# Altium project PCB.PrjPcb
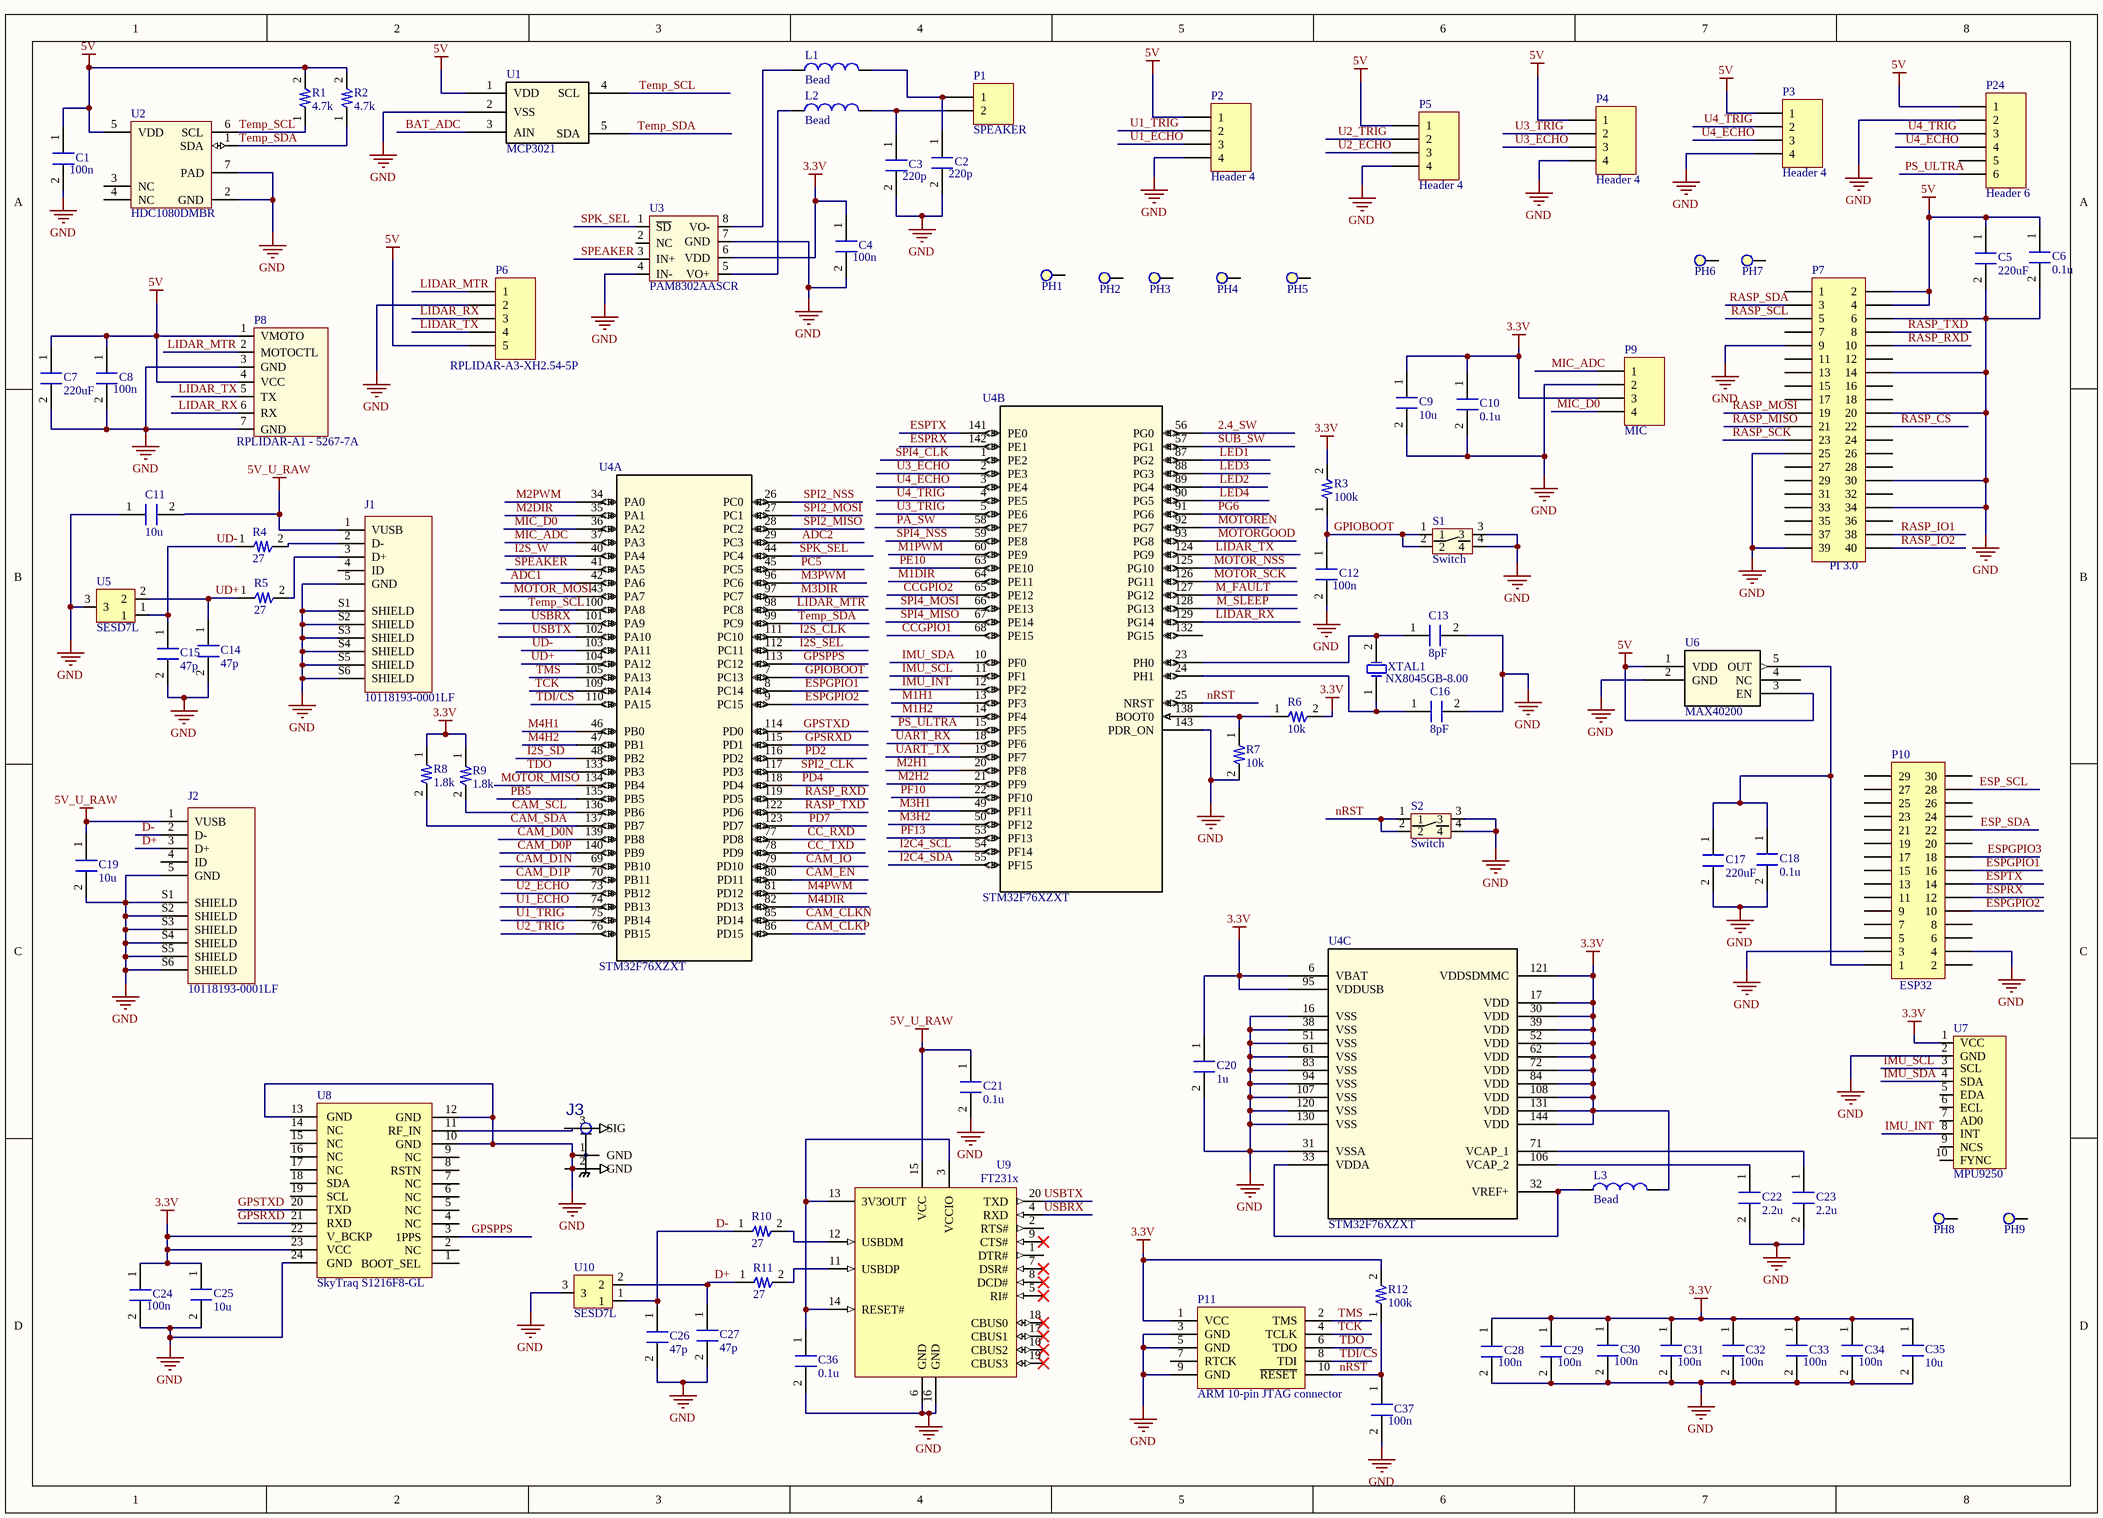
[diagram p0: MCU.SchDoc]
3 sheets, 220 parts. Net scope: global (net labels, ports and power ports of the same name join across sheets).
Board file: PCB.PcbDoc
Sheets:
  MCU.SchDoc
  Peripherals.SchDoc
  Power.SchDoc

## Sheet MCU.SchDoc
size A3

### Parts
C1  value 100n  [Capacitor 0402]  (hidden comment: Ceramic Capacitor)
C2  value 220p  [Capacitor 0402]  (hidden comment: Ceramic Capacitor)
C3  value 220p  [Capacitor 0402]  (hidden comment: Ceramic Capacitor)
C4  value 100n  [Capacitor 0402]  (hidden comment: Ceramic Capacitor)
C5  value 220uF  [CAPAE250P680X1220_VERT]  (hidden comment: Ceramic Capacitor)
C6  value 0.1u  [Capacitor 0402]  (hidden comment: Ceramic Capacitor)
C7  value 220uF  [CAPAE250P680X1220_VERT]  (hidden comment: Ceramic Capacitor)
C8  value 100n  [Capacitor 0402]  (hidden comment: Ceramic Capacitor)
C9  value 10u  [Capacitor 0603]  (hidden comment: Ceramic Capacitor)
C10  value 0.1u  [Capacitor 0402]  (hidden comment: Ceramic Capacitor)
C11  value 10u  [Capacitor 0603]  (hidden comment: Ceramic Capacitor)
C12  value 100n  [Capacitor 0402]  (hidden comment: Ceramic Capacitor)
C13  value 8pF  [Capacitor 0402]  (hidden comment: Ceramic Capacitor)
C14  value 47p  [Capacitor 0402]  (hidden comment: Ceramic Capacitor)
C15  value 47p  [Capacitor 0402]  (hidden comment: Ceramic Capacitor)
C16  value 8pF  [Capacitor 0402]  (hidden comment: Ceramic Capacitor)
C17  value 220uF  [CAPAE250P680X1220_VERT]  (hidden comment: Ceramic Capacitor)
C18  value 0.1u  [Capacitor 0402]  (hidden comment: Ceramic Capacitor)
C19  value 10u  [Capacitor 0603]  (hidden comment: Ceramic Capacitor)
C20  value 1u  [Capacitor 0402]  (hidden comment: Ceramic Capacitor)
C21  value 0.1u  [Capacitor 0402]  (hidden comment: Ceramic Capacitor)
C22  value 2.2u  [Capacitor 0402]  (hidden comment: Ceramic Capacitor)
C23  value 2.2u  [Capacitor 0402]  (hidden comment: Ceramic Capacitor)
C24  value 100n  [Capacitor 0402]  (hidden comment: Ceramic Capacitor)
C25  value 10u  [Capacitor 0603]  (hidden comment: Ceramic Capacitor)
C26  value 47p  [Capacitor 0402]  (hidden comment: Ceramic Capacitor)
C27  value 47p  [Capacitor 0402]  (hidden comment: Ceramic Capacitor)
C28  value 100n  [Capacitor 0402]  (hidden comment: Ceramic Capacitor)
C29  value 100n  [Capacitor 0402]  (hidden comment: Ceramic Capacitor)
C30  value 100n  [Capacitor 0402]  (hidden comment: Ceramic Capacitor)
C31  value 100n  [Capacitor 0402]  (hidden comment: Ceramic Capacitor)
C32  value 100n  [Capacitor 0402]  (hidden comment: Ceramic Capacitor)
C33  value 100n  [Capacitor 0402]  (hidden comment: Ceramic Capacitor)
C34  value 100n  [Capacitor 0402]  (hidden comment: Ceramic Capacitor)
C35  value 10u  [Capacitor 0603]  (hidden comment: Ceramic Capacitor)
C36  value 0.1u  [Capacitor 0402]  (hidden comment: Ceramic Capacitor)
C37  value 100n  [Capacitor 0402]  (hidden comment: Ceramic Capacitor)
J1  10118193-0001LF  [FCI_10118193-0001LF_10118193-0001LF(Primary)]
J2  10118193-0001LF  [FCI_10118193-0001LF_10118193-0001LF(Primary)]
J3  U.FL-R-SMT(01)  [HRS_U.FL-R-SMT(01)]  (value not drawn)
L1  Bead  [Resistor 0603]
L2  Bead  [Resistor 0603]
L3  Bead  [Resistor 0603]
P1  SPEAKER  [HDR1X2]
P2  Header 4  [HDR1X4]
P3  Header 4  [HDR1X4]
P4  Header 4  [HDR1X4]
P5  Header 4  [HDR1X4]
P6  RPLIDAR-A3-XH2.54-5P  [HDR1X5]
P7  PI 3.0  [HDR2X20]
P8  RPLIDAR-A1 - 5267-7A  [HDR1X7]
P9  MIC  [HDR1X4]
P10  ESP32  [ESP32]
P11  ARM 10-pin JTAG connector  [MHDR2X5]
P24  Header 6  [HDR1X6]
PH1  Plated Hole  [PH-M3-A]  (value not drawn)
PH2  Plated Hole  [PH-M3-A]  (value not drawn)
PH3  Plated Hole  [PH-M3-A]  (value not drawn)
PH4  Plated Hole  [PH-M3-A]  (value not drawn)
PH5  Plated Hole  [PH-M3-A]  (value not drawn)
PH6  Plated Hole  [PH-M2-A]  (value not drawn)
PH7  Plated Hole  [PH-M2-A]  (value not drawn)
PH8  Plated Hole  [PH-M3-A]  (value not drawn)
PH9  Plated Hole  [PH-M3-A]  (value not drawn)
R1  value 4.7k  [Resistor 0402]  (hidden comment: Resistor)
R2  value 4.7k  [Resistor 0402]  (hidden comment: Resistor)
R3  value 100k  [Resistor 0402]  (hidden comment: Resistor)
R4  value 27  [Resistor 0402]  (hidden comment: Resistor)
R5  value 27  [Resistor 0402]  (hidden comment: Resistor)
R6  value 10k  [Resistor 0402]  (hidden comment: Resistor)
R7  value 10k  [Resistor 0402]  (hidden comment: Resistor)
R8  value 1.8k  [Resistor 0402]  (hidden comment: Resistor)
R9  value 1.8k  [Resistor 0402]  (hidden comment: Resistor)
R10  value 27  [Resistor 0402]  (hidden comment: Resistor)
R11  value 27  [Resistor 0402]  (hidden comment: Resistor)
R12  value 100k  [Resistor 0402]  (hidden comment: Resistor)
S1  Switch  [Switch]
S2  Switch  [Switch]
U1  MCP3021  [SOT23-5N]
U2  HDC1080DMBR  [DMB0006A]
U3  PAM8302AASCR  [MSOP-MS8_N]
U4  STM32F76XZXT  [LQFP-144_20X20mm]  (parts A,B,C of 3)
U5  SESD7L  [SOT-723]
U6  MAX40200  [21-0057F]
U7  MPU9250  [HDR1X10]
U8  SkyTraq S1216F8-GL  [SkyTraq S1216F8-GL]
U9  FT231x  [SSOP-20_N]
U10  SESD7L  [SOT-723]
XTAL1  NX8045GB-8.00  [NX8045G 8MHz Crystal]

### Nets
3.3V: C4.1 C9.1 C10.1 C20.1 C24.1 C25.1 C28.1 C29.1 C30.1 C31.1 C32.1 C33.1 C34.1 C35.1 L3.2 P9.3 P11.1(VCC) R3.2 R6.2 R8.1 R9.1 R12.2 U3.6(VDD) U4.6(VBAT) U4.17(VDD) U4.30(VDD) U4.39(VDD) U4.52(VDD) U4.62(VDD) U4.72(VDD) U4.84(VDD) U4.95(VDDUSB) U4.108(VDD) U4.121(VDDSDMMC) U4.131(VDD) U4.144(VDD) U7.1(VCC) U8.22(V_BCKP) U8.23(VCC)
5V: C1.1 C5.1 C6.1 C7.1 C8.1 P2.1 P3.1 P4.1 P5.1 P6.5 P7.2 P7.4 P8.1(VMOTO) P8.4(VCC) P24.1 R1.2 R2.2 U1.1(VDD) U2.5(VDD) U6.1(VDD) U6.3(EN)
5V_U_RAW: C11.2 C19.1 C21.1 J1.1(VUSB) J2.1(VUSB) U9.15(VCC)
GND: C1.2 C2.2 C3.2 C4.2 C5.2 C6.2 C7.2 C8.2 C9.2 C10.2 C11.1 C12.2 C13.2 C14.2 C15.2 C16.2 C17.2 C18.2 C19.2 C20.2 C21.2 C22.2 C23.2 C24.2 C25.2 C26.2 C27.2 C28.2 C29.2 C30.2 C31.2 C32.2 C33.2 C34.2 C35.2 C36.2 C37.2 J1.5(GND) J1.S1(SHIELD) J1.S2(SHIELD) J1.S3(SHIELD) J1.S4(SHIELD) J1.S5(SHIELD) J1.S6(SHIELD) J2.5(GND) J2.S1(SHIELD) J2.S2(SHIELD) J2.S3(SHIELD) J2.S4(SHIELD) J2.S5(SHIELD) J2.S6(SHIELD) J3.1(GND) J3.2(GND) P2.4 P3.4 P4.4 P5.4 P6.2 P7.6 P7.9 P7.14 P7.20 P7.25 P7.30 P7.34 P7.39 P8.3(GND) P8.7(GND) P9.2 P10.3 P10.4 P11.3(GND) P11.5(GND) P11.9(GND) P24.2 R7.2 S1.3 S1.4 S2.3 S2.4 U1.2(VSS) U2.2(GND) U2.7(PAD) U3.4(IN-) U3.7(GND) U4.16(VSS) U4.31(VSSA) U4.38(VSS) U4.51(VSS) U4.61(VSS) U4.83(VSS) U4.94(VSS) U4.107(VSS) U4.120(VSS) U4.130(VSS) U4.143(PDR_ON) U5.3 U6.2(GND) U7.2(GND) U8.10(GND) U8.12(GND) U8.13(GND) U8.24(GND) U9.6(GND) U9.16(GND) U10.3
2.4_SW: U4.56(PG0)
ADC1: U4.42(PA6)
ADC2: U4.29(PC3)
BAT_ADC: U1.3(AIN)
CAM_CLKN: U4.85(PD14)
CAM_CLKP: U4.86(PD15)
CAM_D0N: U4.139(PB8)
CAM_D0P: U4.140(PB9)
CAM_D1N: U4.69(PB10)
CAM_D1P: U4.70(PB11)
CAM_EN: U4.80(PD11)
CAM_IO: U4.79(PD10)
CAM_SCL: R9.2 U4.136(PB6)
CAM_SDA: R8.2 U4.137(PB7)
CC_RXD: U4.77(PD8)
CC_TXD: U4.78(PD9)
CCGPIO1: U4.68(PE15)
CCGPIO2: U4.65(PE12)
D+: C27.1 J2.3(D+) R11.1 U10.2
D-: C26.1 J2.2(D-) R10.1 U10.1
ESP_SCL: P10.28
ESP_SDA: P10.22
ESPGPIO1: P10.16 U4.8(PC14)
ESPGPIO2: P10.10 U4.9(PC15)
ESPGPIO3: P10.18
ESPRX: P10.12 U4.142(PE1)
ESPTX: P10.14 U4.141(PE0)
GPIOBOOT: C12.1 R3.1 S1.1 S1.2 U4.7(PC13)
GPSPPS: U4.113(PC12) U8.3(1PPS)
GPSRXD: U4.115(PD1) U8.21(RXD)
GPSTXD: U4.114(PD0) U8.20(TXD)
I2C4_SCL: U4.54(PF14)
I2C4_SDA: U4.55(PF15)
I2S_CLK: U4.111(PC10)
I2S_SD: U4.48(PB2)
I2S_SEL: U4.112(PC11)
I2S_W: U4.40(PA4)
IMU_INT: U4.12(PF2) U7.8(INT)
IMU_SCL: U4.11(PF1) U7.3(SCL)
IMU_SDA: U4.10(PF0) U7.4(SDA)
LED1: U4.87(PG2)
LED2: U4.89(PG4)
LED3: U4.88(PG3)
LED4: U4.90(PG5)
LIDAR_MTR: P6.1 P8.2(MOTOCTL) U4.98(PC8)
LIDAR_RX: P6.3 P8.6(RX) U4.129(PG14)
LIDAR_TX: P6.4 P8.5(TX) U4.124(PG9)
M1DIR: U4.64(PE11)
M1H1: U4.13(PF3)
M1H2: U4.14(PF4)
M1PWM: U4.60(PE9)
M2DIR: U4.35(PA1)
M2H1: U4.20(PF8)
M2H2: U4.21(PF9)
M2PWM: U4.34(PA0)
M3DIR: U4.97(PC7)
M3H1: U4.49(PF11)
M3H2: U4.50(PF12)
M3PWM: U4.96(PC6)
M4DIR: U4.82(PD13)
M4H1: U4.46(PB0)
M4H2: U4.47(PB1)
M4PWM: U4.81(PD12)
M_FAULT: U4.127(PG12)
M_SLEEP: U4.128(PG13)
MIC_ADC: P9.1 U4.37(PA3)
MIC_D0: P9.4 U4.36(PA2)
MOTOR_MISO: U4.134(PB4)
MOTOR_MOSI: U4.43(PA7)
MOTOR_NSS: U4.125(PG10)
MOTOR_SCK: U4.126(PG11)
MOTOREN: U4.92(PG7)
MOTORGOOD: U4.93(PG8)
nRST: C37.1 P11.10(~{RESET}) R12.1 S2.1 S2.2 U4.25(NRST)
PA_SW: U4.58(PE7)
PB5: U4.135(PB5)
PC5: U4.45(PC5)
PD2: U4.116(PD2)
PD4: U4.118(PD4)
PD7: U4.123(PD7)
PE10: U4.63(PE10)
PF10: U4.22(PF10)
PF13: U4.53(PF13)
PG6: U4.91(PG6)
PS_ULTRA: P24.6 U4.15(PF5)
RASP_CS: P7.22
RASP_IO1: P7.38
RASP_IO2: P7.40
RASP_MISO: P7.21
RASP_MOSI: P7.19
RASP_RXD: P7.10 U4.119(PD5)
RASP_SCK: P7.23
RASP_SCL: P7.5
RASP_SDA: P7.3
RASP_TXD: P7.8 U4.122(PD6)
SPEAKER: U3.3(IN+) U4.41(PA5)
SPI2_CLK: U4.117(PD3)
SPI2_MISO: U4.28(PC2)
SPI2_MOSI: U4.27(PC1)
SPI2_NSS: U4.26(PC0)
SPI4_CLK: U4.1(PE2)
SPI4_MISO: U4.67(PE14)
SPI4_MOSI: U4.66(PE13)
SPI4_NSS: U4.59(PE8)
SPK_SEL: U3.1(~{SD}) U4.44(PC4)
SUB_SW: U4.57(PG1)
TCK: P11.4(TCLK) U4.109(PA14)
TDI/CS: P11.8(TDI) U4.110(PA15)
TDO: P11.6(TDO) U4.133(PB3)
Temp_SCL: R1.1 U1.4(SCL) U2.6(SCL) U4.100(PA8)
Temp_SDA: R2.1 U1.5(SDA) U2.1(SDA) U4.99(PC9)
TMS: P11.2(TMS) U4.105(PA13)
U1_ECHO: P2.3 U4.74(PB13)
U1_TRIG: P2.2 U4.75(PB14)
U2_ECHO: P5.3 U4.73(PB12)
U2_TRIG: P5.2 U4.76(PB15)
U3_ECHO: P4.3 U4.2(PE3)
U3_TRIG: P4.2 U4.5(PE6)
U4_ECHO: P3.3 P24.4 U4.3(PE4)
U4_TRIG: P3.2 P24.3 U4.4(PE5)
UART_RX: U4.18(PF6)
UART_TX: U4.19(PF7)
UD+: C14.1 R5.1 U4.104(PA12) U5.2
UD-: C15.1 R4.1 U4.103(PA11) U5.1
USBRX: U4.101(PA9) U9.4(RXD)
USBTX: U4.102(PA10) U9.20(TXD)
NetC2_1: C2.1 L1.2 P1.1
NetC3_1: C3.1 L2.2 P1.2
NetC13_1: C13.1 U4.23(PH0) XTAL1.2(OSC2)
NetC16_1: C16.1 U4.24(PH1) XTAL1.1(OSC1)
NetC17_1: C17.1 C18.1 P10.1 U6.5(OUT)
NetC22_1: C22.1 U4.106(VCAP_2)
NetC23_1: C23.1 U4.71(VCAP_1)
NetC36_1: C36.1 U9.3(VCCIO) U9.13(3V3OUT) U9.14(RESET#)
NetJ1_2: J1.2(D-) R4.2
NetJ1_3: J1.3(D+) R5.2
NetJ3_3: J3.3(SIG) U8.11(RF_IN)
NetL1_1: L1.1 U3.8(VO-)
NetL2_1: L2.1 U3.5(VO+)
NetL3_1: L3.1 U4.32(VREF+) U4.33(VDDA)
NetR6_1: R6.1 R7.1 U4.138(BOOT0)
NetR10_2: R10.2 U9.12(USBDM)
NetR11_2: R11.2 U9.11(USBDP)

Not connected (* = marked no-connect by the designer): J1 4(ID); J2 4(ID); P7 1 7 11 12 13 15 16 17 18 24 26 27 28 29 31 32 33 35 36 37; P10 2 5 6 7 8 9 11 13 15 17 19 20 21 23 24 25 26 27 29 30; P11 7(RTCK); P24 5; PH1 1(Hole); PH2 1(Hole); PH3 1(Hole); PH4 1(Hole); PH5 1(Hole); PH6 1(Hole); PH7 1(Hole); PH8 1(Hole); PH9 1(Hole); U2 3(NC) 4(NC); U3 2(NC); U4 132(PG15); U6 4(NC); U7 5(EDA) 6(ECL) 7(AD0) 9(NCS) 10(FYNC); U8 1(BOOT_SEL) 2(NC) 4(NC) 5(NC) 6(NC) 7(NC) 8(RSTN) 9(NC) 14(NC) 15(NC) 16(NC) 17(NC) 18(SDA) 19(SCL); U9 1(DTR#) 2(RTS#) 5(RI#)* 7(DSR#)* 8(DCD#)* 9(CTS#)* 10(CBUS2)* 17(CBUS1)* 18(CBUS0)* 19(CBUS3)*

### Library data of the parts
J1 J2 = USB mini 10118193-0001LF: USB mini; Digikey: *
J3 = U.FL-R-SMT(01): U.FL Series 6 Ghz 50 Ohm Ultra-small SMT Coaxial Cable Receptacle; MF: Hirose; Price: 0.80 USD; Availability: Good; Package: None; MP: U.FL-R-SMT(01); Value: *
L1-L3 = Inductor: Digikey: 490-13259-1-ND
P1 = Header 2: Header, 2-Pin; LatestRevisionDate: 17-Jul-2002; LatestRevisionNote: Re-released for DXP Platform.; Publisher: Altium Limited
P2-P5 P9 = Header 4: Header, 4-Pin; LatestRevisionDate: 17-Jul-2002; LatestRevisionNote: Re-released for DXP Platform.; Publisher: Altium Limited
P6 = Header 5: Header, 5-Pin; LatestRevisionDate: 17-Jul-2002; LatestRevisionNote: Re-released for DXP Platform.; Publisher: Altium Limited
P7 = Header 20X2: Header, 20-Pin, Dual row; LatestRevisionDate: 17-Jul-2002; LatestRevisionNote: Re-released for DXP Platform.; Publisher: Altium Limited
P8 = RPLIDAR A1
P10 = Header 15X2: Header, 15-Pin, Dual row; LatestRevisionDate: 17-Jul-2002; LatestRevisionNote: Re-released for DXP Platform.; Publisher: Altium Limited
P11 = ARM JTAG: ARM JTAG/SWD connector; Farnell Code: 1865279
P24 = Header 6: Header, 6-Pin; LatestRevisionDate: 17-Jul-2002; LatestRevisionNote: Re-released for DXP Platform.; Publisher: Altium Limited
PH1-PH9 = PH: Plated hole for threaded rods; LatestRevisionDate: 31-07-2014; Published: 31-07-2014; Publisher: N.F.Baltazar Santos - DelFFi
R1-R12 = Resistor: General Purpose Resistor
  R1-R3 R6-R9 R12: Digikey: *
  R4 R5 R10 R11: Digikey: P27DDCT-ND
U1 = MCP3021: ADC
U2 = HDC1080DMBR: No Description Available; Application_BuildNumber: *
U3 = PAM8302AASCR: Speaker amplifier
U4 = STM32F76XZXT: Imported; Vendor: STMicroelectronics; C: Copyright (C) 2016 Accelerated Designs. All rights reserved; Manufacturer_Part_Number: stm32f76xzxt; Copyright: Copyright (C) 2016 Accelerated Designs. All rights reserved; RefDes: RefDes; Type: DEV; Value: Value
U5 U10 = SESD7L: TVS Diode - USB
U6 = MAX40200: No Description Available
U8 = SkyTraq S1216F8-GL: Skytraq S1216F8-GL GPS chip
XTAL1 = NDK NX8045G 8MHz: Surface Mount Quartz Crystal; Value: 8MHz; Digikey: NX8045GB-8.00
C1-C37 = Ceramic Capacitor
  C1-C13 C16-C25 C28-C37: Digikey: *
  C14 C15 C26 C27: Digikey: 445-5592-1-ND
U9 = FT231x: Digikey: 768-1129-1-ND

## Sheet Peripherals.SchDoc
size A3
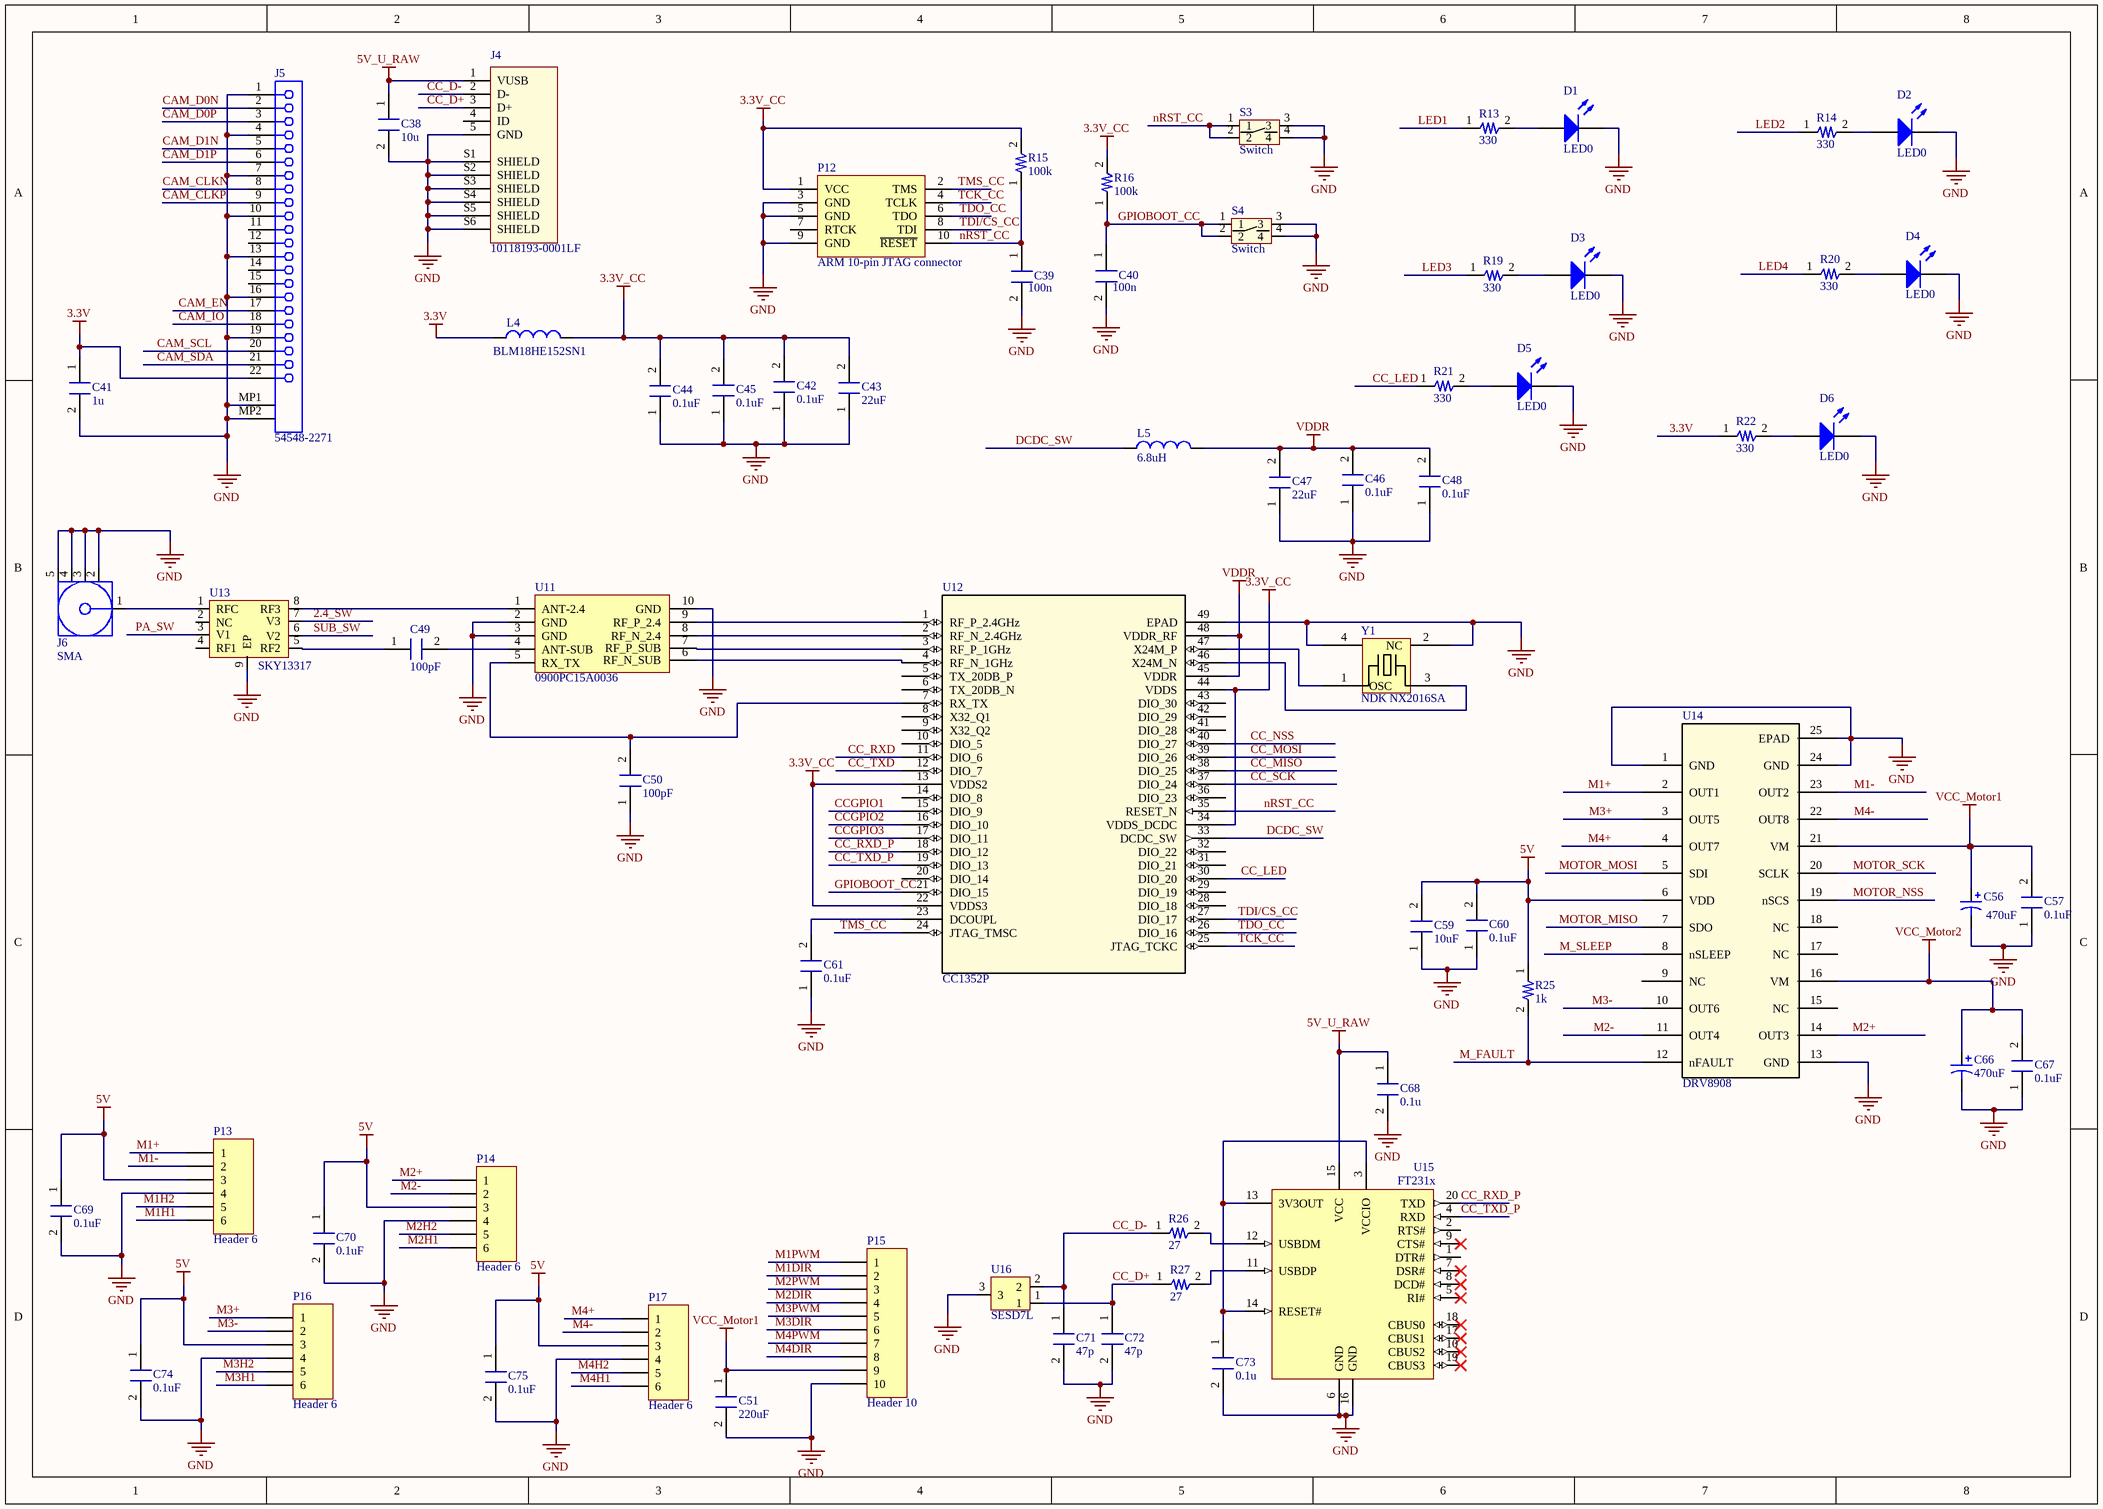
[diagram p1: Peripherals.SchDoc]

### Parts
C38  value 10u  [Capacitor 0603]  (hidden comment: Ceramic Capacitor)
C39  value 100n  [Capacitor 0402]  (hidden comment: Ceramic Capacitor)
C40  value 100n  [Capacitor 0402]  (hidden comment: Ceramic Capacitor)
C41  value 1u  [Capacitor 0402]  (hidden comment: Ceramic Capacitor)
C42  value 0.1uF  [Capacitor 0402]  (hidden comment: Ceramic Capacitor)
C43  value 22uF  [Capacitor 0603]  (hidden comment: Ceramic Capacitor)
C44  value 0.1uF  [Capacitor 0402]  (hidden comment: Ceramic Capacitor)
C45  value 0.1uF  [Capacitor 0402]  (hidden comment: Ceramic Capacitor)
C46  value 0.1uF  [Capacitor 0402]  (hidden comment: Ceramic Capacitor)
C47  value 22uF  [Capacitor 0603]  (hidden comment: Ceramic Capacitor)
C48  value 0.1uF  [Capacitor 0402]  (hidden comment: Ceramic Capacitor)
C49  value 100pF  [Capacitor 0402]  (hidden comment: Ceramic Capacitor)
C50  value 100pF  [Capacitor 0402]  (hidden comment: Ceramic Capacitor)
C51  value 220uF  [CAPAE250P680X1220_VERT]  (hidden comment: Ceramic Capacitor)
C56  470uF  [RB7.6-15]
C57  value 0.1uF  [Capacitor 0402]  (hidden comment: Ceramic Capacitor)
C59  value 10uF  [Capacitor 0603]  (hidden comment: Ceramic Capacitor)
C60  value 0.1uF  [Capacitor 0402]  (hidden comment: Ceramic Capacitor)
C61  value 0.1uF  [Capacitor 0402]  (hidden comment: Ceramic Capacitor)
C66  470uF  [RB7.6-15]
C67  value 0.1uF  [Capacitor 0402]  (hidden comment: Ceramic Capacitor)
C68  value 0.1u  [Capacitor 0402]  (hidden comment: Ceramic Capacitor)
C69  value 0.1uF  [Capacitor 0402]  (hidden comment: Ceramic Capacitor)
C70  value 0.1uF  [Capacitor 0402]  (hidden comment: Ceramic Capacitor)
C71  value 47p  [Capacitor 0402]  (hidden comment: Ceramic Capacitor)
C72  value 47p  [Capacitor 0402]  (hidden comment: Ceramic Capacitor)
C73  value 0.1u  [Capacitor 0402]  (hidden comment: Ceramic Capacitor)
C74  value 0.1uF  [Capacitor 0402]  (hidden comment: Ceramic Capacitor)
C75  value 0.1uF  [Capacitor 0402]  (hidden comment: Ceramic Capacitor)
D1  LED0  [HDR1X2]
D2  LED0  [HDR1X2]
D3  LED0  [HDR1X2]
D4  LED0  [HDR1X2]
D5  LED0  [HDR1X2]
D6  LED0  [HDR1X2]
J4  10118193-0001LF  [FCI_10118193-0001LF_10118193-0001LF(Primary)]
J5  54548-2271  [54548-2271]
J6  SMA  [SMA4.75V5A - Straight]
L4  BLM18HE152SN1  [Resistor 0603]
L5  6.8uH  [B82144F2682K000]
P12  ARM 10-pin JTAG connector  [MHDR2X5]
P13  Header 6  [HDR1X6]
P14  Header 6  [HDR1X6]
P15  Header 10  [HDR1X10]
P16  Header 6  [HDR1X6]
P17  Header 6  [HDR1X6]
R13  value 330  [Resistor 0402]  (hidden comment: Resistor)
R14  value 330  [Resistor 0402]  (hidden comment: Resistor)
R15  value 100k  [Resistor 0402]  (hidden comment: Resistor)
R16  value 100k  [Resistor 0402]  (hidden comment: Resistor)
R19  value 330  [Resistor 0402]  (hidden comment: Resistor)
R20  value 330  [Resistor 0402]  (hidden comment: Resistor)
R21  value 330  [Resistor 0402]  (hidden comment: Resistor)
R22  value 330  [Resistor 0402]  (hidden comment: Resistor)
R25  value 1k  [Resistor 0402]  (hidden comment: Resistor)
R26  value 27  [Resistor 0402]  (hidden comment: Resistor)
R27  value 27  [Resistor 0402]  (hidden comment: Resistor)
S3  Switch  [Switch]
S4  Switch  [Switch]
U11  0900PC15A0036  [0900PC15A0036]
U12  CC1352P  [RGZ48]
U13  SKY13317  [DFN-8_DC]
U14  DRV8908  [HTTSOP 24]
U15  FT231x  [SSOP-20_N]
U16  SESD7L  [SOT-723]
Y1  NDK NX2016SA  [NDK NX2016SA]

### Nets
3.3V: C41.1 J5.22 L4.1 R22.1
3.3V_CC: C42.2 C43.2 C44.2 C45.2 L4.2 P12.1(VCC) R15.2 R16.2 U12.13(VDDS2) U12.22(VDDS3) U12.34(VDDS_DCDC) U12.44(VDDS)
5V: C59.2 C60.2 C69.1 C70.1 C74.1 C75.1 P13.3 P14.3 P16.3 P17.3 R25.1 U14.6(VDD)
5V_U_RAW: C38.1 C68.1 J4.1(VUSB) U15.15(VCC)
GND: C38.2 C39.2 C40.2 C41.2 C42.1 C43.1 C44.1 C45.1 C46.1 C47.1 C48.1 C50.1 C51.2 C56.2 C57.1 C59.1 C60.1 C61.1 C66.2 C67.1 C68.2 C69.2 C70.2 C71.2 C72.2 C73.2 C74.2 C75.2 D1.2(K) D2.2(K) D3.2(K) D4.2(K) D5.2(K) D6.2(K) J4.5(GND) J4.S1(SHIELD) J4.S2(SHIELD) J4.S3(SHIELD) J4.S4(SHIELD) J4.S5(SHIELD) J4.S6(SHIELD) J5.1 J5.4 J5.7 J5.10 J5.13 J5.16 J5.19 J5.MP1 J5.MP2 J6.2 J6.3 J6.4 J6.5 P12.3(GND) P12.5(GND) P12.9(GND) P13.4 P14.4 P15.10 P16.4 P17.4 S3.3 S3.4 S4.3 S4.4 U11.2(GND) U11.3(GND) U11.10(GND) U12.49(EPAD) U13.9(EP) U14.1(GND) U14.13(GND) U14.24(GND) U14.25(EPAD) U15.6(GND) U15.16(GND) U16.3 Y1.2(NC) Y1.4(NC)
VCC_Motor1: C51.1 C56.1 C57.2 P15.9 U14.21(VM)
VCC_Motor2: C66.1 C67.2 U14.16(VM)
VDDR: C46.2 C47.2 C48.2 L5.2 U12.45(VDDR) U12.48(VDDR_RF)
2.4_SW: U13.7(V3)
CAM_CLKN: J5.8
CAM_CLKP: J5.9
CAM_D0N: J5.2
CAM_D0P: J5.3
CAM_D1N: J5.5
CAM_D1P: J5.6
CAM_EN: J5.17
CAM_IO: J5.18
CAM_SCL: J5.20
CAM_SDA: J5.21
CC_D+: C72.1 J4.3(D+) R27.1 U16.1
CC_D-: C71.1 J4.2(D-) R26.1 U16.2
CC_LED: R21.1 U12.30(DIO_20)
CC_MISO: U12.38(DIO_25)
CC_MOSI: U12.39(DIO_26)
CC_NSS: U12.40(DIO_27)
CC_RXD: U12.11(DIO_6)
CC_RXD_P: U12.18(DIO_12) U15.20(TXD)
CC_SCK: U12.37(DIO_24)
CC_TXD: U12.12(DIO_7)
CC_TXD_P: U12.19(DIO_13) U15.4(RXD)
CCGPIO1: U12.15(DIO_9)
CCGPIO2: U12.16(DIO_10)
CCGPIO3: U12.17(DIO_11)
DCDC_SW: L5.1 U12.33(DCDC_SW)
GPIOBOOT_CC: C40.1 R16.1 S4.1 S4.2 U12.21(DIO_15)
LED1: R13.1
LED2: R14.1
LED3: R19.1
LED4: R20.1
M1+: P13.1 U14.2(OUT1)
M1-: P13.2 U14.23(OUT2)
M1DIR: P15.2
M1H1: P13.6
M1H2: P13.5
M1PWM: P15.1
M2+: P14.1 U14.14(OUT3)
M2-: P14.2 U14.11(OUT4)
M2DIR: P15.4
M2H1: P14.6
M2H2: P14.5
M2PWM: P15.3
M3+: P16.1 U14.3(OUT5)
M3-: P16.2 U14.10(OUT6)
M3DIR: P15.6
M3H1: P16.6
M3H2: P16.5
M3PWM: P15.5
M4+: P17.1 U14.4(OUT7)
M4-: P17.2 U14.22(OUT8)
M4DIR: P15.8
M4H1: P17.6
M4H2: P17.5
M4PWM: P15.7
M_FAULT: R25.2 U14.12(nFAULT)
M_SLEEP: U14.8(nSLEEP)
MOTOR_MISO: U14.7(SDO)
MOTOR_MOSI: U14.5(SDI)
MOTOR_NSS: U14.19(nSCS)
MOTOR_SCK: U14.20(SCLK)
nRST_CC: C39.1 P12.10(~{RESET}) R15.1 S3.1 S3.2 U12.35(RESET_N)
PA_SW: U13.3(V1)
SUB_SW: U13.6(V2)
TCK_CC: P12.4(TCLK) U12.25(JTAG_TCKC)
TDI/CS_CC: P12.8(TDI) U12.27(DIO_17)
TDO_CC: P12.6(TDO) U12.26(DIO_16)
TMS_CC: P12.2(TMS) U12.24(JTAG_TMSC)
NetC49_1: C49.1 U13.5(RF2)
NetC49_2: C49.2 U11.4(ANT-SUB)
NetC50_2: C50.2 U11.5(RX_TX) U12.7(RX_TX)
NetC61_2: C61.2 U12.23(DCOUPL)
NetC73_1: C73.1 U15.3(VCCIO) U15.13(3V3OUT) U15.14(RESET#)
NetD1_1: D1.1(A) R13.2
NetD2_1: D2.1(A) R14.2
NetD3_1: D3.1(A) R19.2
NetD4_1: D4.1(A) R20.2
NetD5_1: D5.1(A) R21.2
NetD6_1: D6.1(A) R22.2
NetJ6_1: J6.1 U13.1(RFC)
NetR26_2: R26.2 U15.12(USBDM)
NetR27_2: R27.2 U15.11(USBDP)
NetU11_1: U11.1(ANT-2.4) U13.8(RF3)
NetU11_6: U11.6(RF_N_SUB) U12.4(RF_N_1GHz)
NetU11_7: U11.7(RF_P_SUB) U12.3(RF_P_1GHz)
NetU11_8: U11.8(RF_N_2.4) U12.2(RF_N_2.4GHz)
NetU11_9: U11.9(RF_P_2.4) U12.1(RF_P_2.4GHz)
NetU12_46: U12.46(X24M_N) Y1.3(OSC)
NetU12_47: U12.47(X24M_P) Y1.1(OSC)

Not connected (* = marked no-connect by the designer): J4 4(ID); J5 11 12 14 15; P12 7(RTCK); U12 5(TX_20DB_P) 6(TX_20DB_N) 8(X32_Q1) 9(X32_Q2) 10(DIO_5) 14(DIO_8) 20(DIO_14) 28(DIO_18) 29(DIO_19) 31(DIO_21) 32(DIO_22) 36(DIO_23) 41(DIO_28) 42(DIO_29) 43(DIO_30); U13 2(NC) 4(RF1); U14 9(NC) 15(NC) 17(NC) 18(NC); U15 1(DTR#) 2(RTS#) 5(RI#)* 7(DSR#)* 8(DCD#)* 9(CTS#)* 10(CBUS2)* 17(CBUS1)* 18(CBUS0)* 19(CBUS3)*

### Library data of the parts
C56 C66 = Cap Pol1: Polarized Capacitor (Radial); Published: 8-Jun-2000; LatestRevisionDate: 17-Jul-2002; LatestRevisionNote: Re-released for DXP Platform.; PackageReference: RB7.6-15; Publisher: Altium Limited; PackageDescription: Polarized Capacitor (Radial); 2 Leads
D1-D6 = LED0: Typical INFRARED GaAs LED; Published: 8-Jun-2000; LatestRevisionDate: 08-Jul-2005; LatestRevisionNote: Mech Layer 1 removed.; PackageReference: LED-0; Publisher: Altium Limited; PackageDescription: LED; 2 Leads
J4 = USB mini 10118193-0001LF: USB mini; Digikey: *
L4 L5 = Inductor
  L4: Value: BLM18HE152SN1
  L5: Part number: B82144F2682K000
P12 = ARM JTAG: ARM JTAG/SWD connector; Farnell Code: 1865279
P13 P14 P16 P17 = Header 6: Header, 6-Pin; LatestRevisionDate: 17-Jul-2002; LatestRevisionNote: Re-released for DXP Platform.; Publisher: Altium Limited
P15 = Header 10: Header, 10-Pin; LatestRevisionDate: 17-Jul-2002; LatestRevisionNote: Re-released for DXP Platform.; Publisher: Altium Limited
R13-R16 R19-R22 R25-R27 = Resistor: General Purpose Resistor
  R13-R16 R19-R22 R25: Digikey: *
  R26 R27: Digikey: P27DDCT-ND
U12 = CC1352P: No Description Available
U14 = DRV8908: No Description Available
U16 = SESD7L: TVS Diode - USB
C38-C51 C57 C59-C61 C67-C75 = Ceramic Capacitor
  C38-C51 C57 C59-C61 C67-C70 C73-C75: Digikey: *
  C71 C72: Digikey: 445-5592-1-ND
U15 = FT231x: Digikey: 768-1129-1-ND

## Sheet Power.SchDoc
size A3
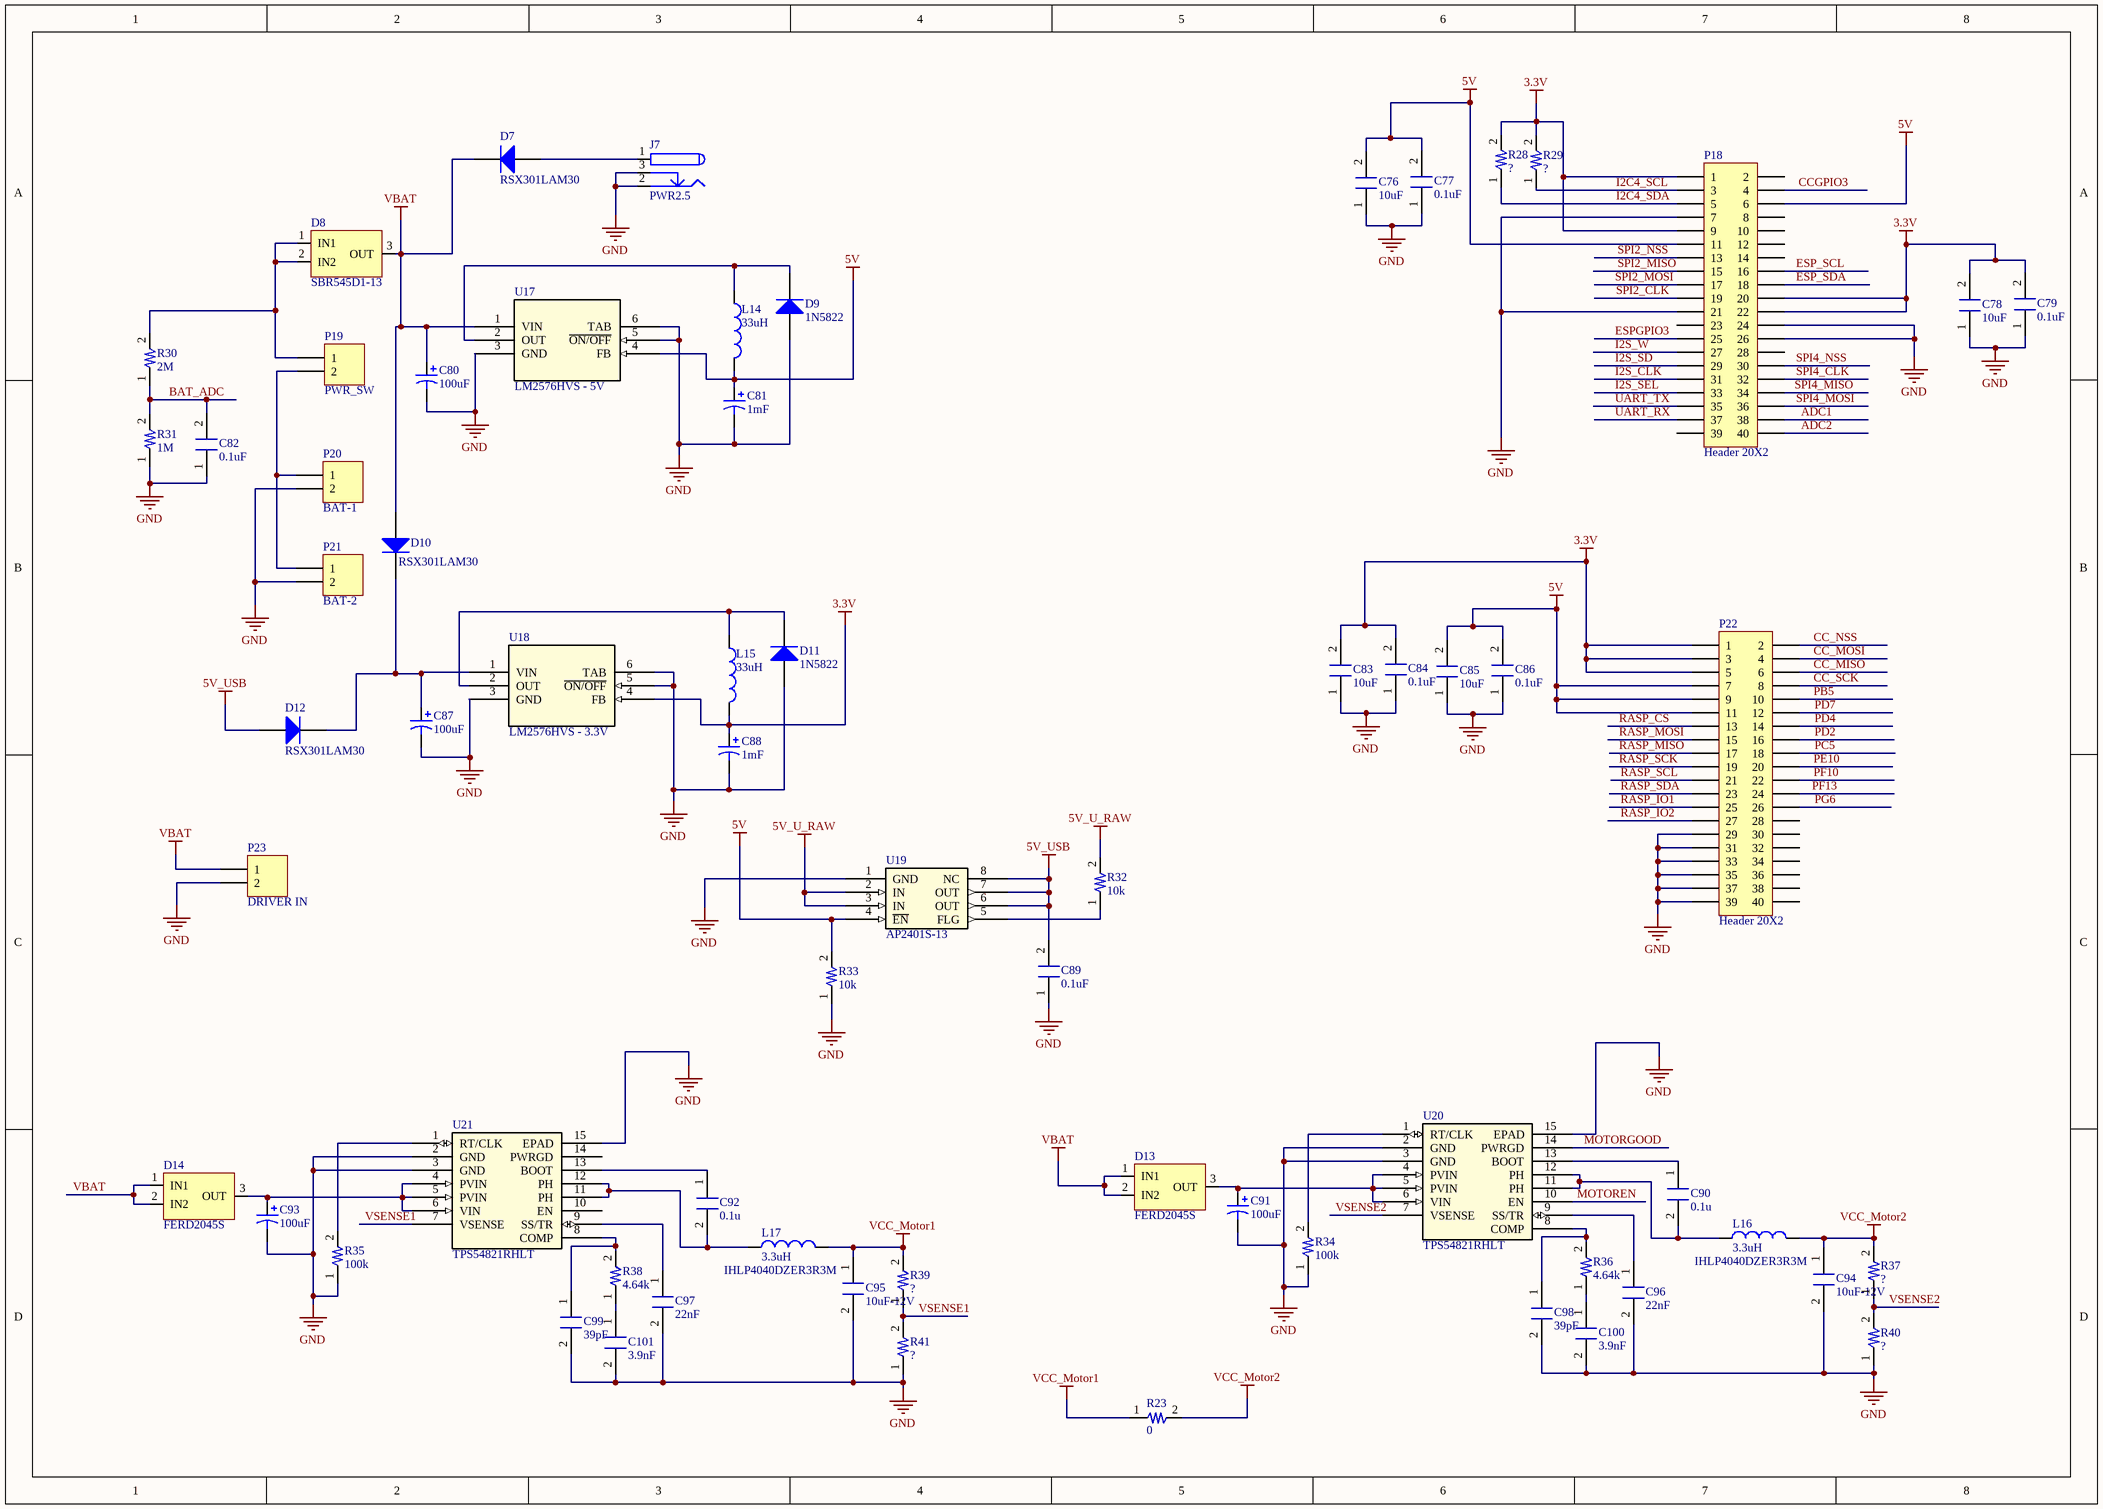
[diagram p2: Power.SchDoc]

### Parts
C76  value 10uF  [Capacitor 0603]  (hidden comment: Ceramic Capacitor)
C77  value 0.1uF  [Capacitor 0402]  (hidden comment: Ceramic Capacitor)
C78  value 10uF  [Capacitor 0603]  (hidden comment: Ceramic Capacitor)
C79  value 0.1uF  [Capacitor 0402]  (hidden comment: Ceramic Capacitor)
C80  100uF  [CAPE5.0mm]
C81  1mF  [CAPE5.0mm]
C82  value 0.1uF  [Capacitor 0402]  (hidden comment: Ceramic Capacitor)
C83  value 10uF  [Capacitor 0603]  (hidden comment: Ceramic Capacitor)
C84  value 0.1uF  [Capacitor 0402]  (hidden comment: Ceramic Capacitor)
C85  value 10uF  [Capacitor 0603]  (hidden comment: Ceramic Capacitor)
C86  value 0.1uF  [Capacitor 0402]  (hidden comment: Ceramic Capacitor)
C87  100uF  [CAPE5.0mm]
C88  1mF  [CAPE5.0mm]
C89  value 0.1uF  [Capacitor 0402]  (hidden comment: Ceramic Capacitor)
C90  value 0.1u  [Capacitor 0603]  (hidden comment: Ceramic Capacitor)
C91  100uF  [CAPE5.0mm]
C92  value 0.1u  [Capacitor 0603]  (hidden comment: Ceramic Capacitor)
C93  100uF  [CAPE5.0mm]
C94  value 10uF-12V  [CAPAE250P680X1220_VERT]  (hidden comment: Ceramic Capacitor)
C95  value 10uF-12V  [CAPAE250P680X1220_VERT]  (hidden comment: Ceramic Capacitor)
C96  value 22nF  [Capacitor 0402]  (hidden comment: Ceramic Capacitor)
C97  value 22nF  [Capacitor 0402]  (hidden comment: Ceramic Capacitor)
C98  value 39pF  [Capacitor 0402]  (hidden comment: Ceramic Capacitor)
C99  value 39pF  [Capacitor 0402]  (hidden comment: Ceramic Capacitor)
C100  value 3.9nF  [Capacitor 0402]  (hidden comment: Ceramic Capacitor)
C101  value 3.9nF  [Capacitor 0402]  (hidden comment: Ceramic Capacitor)
D7  RSX301LAM30  [SOD128]
D8  SBR545D1-13  [TO-252]
D9  1N5822  [DO-201AD]
D10  RSX301LAM30  [SOD128]
D11  1N5822  [DO-201AD]
D12  RSX301LAM30  [SOD128]
D13  FERD2045S  [DPAK]
D14  FERD2045S  [DPAK]
J7  PWR2.5  [KLD-0202]
L14  value 33uH  [IND Coil]  (hidden comment: Inductor)
L15  value 33uH  [IND Coil]  (hidden comment: Inductor)
L16  IHLP4040DZER3R3M  value 3.3uH  [IND_IHLP-4040DZ-]
L17  IHLP4040DZER3R3M  value 3.3uH  [IND_IHLP-4040DZ-]
P18  Header 20X2  [HDR2X20]
P19  PWR_SW  [HDR1X2]
P20  BAT-1  [BAT]
P21  BAT-2  [HDR1X2]
P22  Header 20X2  [HDR2X20]
P23  DRIVER IN  [HDR1X2]
R23  value 0  [Resistor 0805]  (hidden comment: Resistor)
R28  Resistor  [Resistor 0402]  (value not drawn)
R29  Resistor  [Resistor 0402]  (value not drawn)
R30  value 2M  [Resistor 0402]  (hidden comment: Resistor)
R31  value 1M  [Resistor 0402]  (hidden comment: Resistor)
R32  value 10k  [Resistor 0402]  (hidden comment: Resistor)
R33  value 10k  [Resistor 0402]  (hidden comment: Resistor)
R34  value 100k  [Resistor 0402]  (hidden comment: Resistor)
R35  value 100k  [Resistor 0402]  (hidden comment: Resistor)
R36  value 4.64k  [Resistor 0402]  (hidden comment: Resistor)
R37  Resistor  [Resistor 0402]  (value not drawn)
R38  value 4.64k  [Resistor 0402]  (hidden comment: Resistor)
R39  Resistor  [Resistor 0402]  (value not drawn)
R40  Resistor  [Resistor 0402]  (value not drawn)
R41  Resistor  [Resistor 0402]  (value not drawn)
U17  LM2576HVS - 5V  [TS5B]
U18  LM2576HVS - 3.3V  [TS5B]
U19  AP2401S-13  [SO8]
U20  TPS54821RHLT  [RHL14_2P05X2P05]
U21  TPS54821RHLT  [RHL14_2P05X2P05]

### Nets
3.3V: C78.2 C79.2 C83.2 C84.2 C88.1 L15.2 P18.1 P18.9 P18.20 P18.22 P22.1 P22.3 P22.5 R28.2 R29.2 U18.4(FB)
5V: C76.2 C77.2 C81.1 C85.2 C86.2 L14.2 P18.6 P18.11 P22.7 P22.9 P22.11 R33.2 U17.4(FB) U19.4(~{EN})
5V_U_RAW: R32.2 U19.2(IN) U19.3(IN)
5V_USB: C89.2 D12.1(A) U19.6(OUT) U19.7(OUT) U19.8(NC)
GND: C76.1 C77.1 C78.1 C79.1 C80.2 C81.2 C82.1 C83.1 C84.1 C85.1 C86.1 C87.2 C88.2 C89.1 C91.2 C93.2 C94.2 C95.2 C96.2 C97.2 C98.2 C99.2 C100.2 C101.2 D9.1(A) D11.1(A) J7.2 J7.3 P18.7 P18.21 P18.24 P18.26 P20.2 P21.2 P22.29 P22.31 P22.33 P22.35 P22.37 P22.39 P23.2 R31.1 R33.1 R34.1 R35.1 R40.1 R41.1 U17.3(GND) U17.5(~{ON/OFF}) U17.6(TAB) U18.3(GND) U18.5(~{ON/OFF}) U18.6(TAB) U19.1(GND) U20.2(GND) U20.3(GND) U20.15(EPAD) U21.2(GND) U21.3(GND) U21.15(EPAD)
VBAT: C80.1 D7.2(K) D8.3(OUT) D10.1(A) D13.1(IN1) D13.2(IN2) D14.1(IN1) D14.2(IN2) P23.1 U17.1(VIN)
VCC_Motor1: C95.1 L17.2 R23.1 R39.2
VCC_Motor2: C94.1 L16.2 R23.2 R37.2
ADC1: P18.38
ADC2: P18.40
BAT_ADC: C82.2 R30.1 R31.2
CC_MISO: P22.6
CC_MOSI: P22.4
CC_NSS: P22.2
CC_SCK: P22.8
CCGPIO3: P18.4
ESP_SCL: P18.16
ESP_SDA: P18.18
ESPGPIO3: P18.25
I2C4_SCL: P18.3 R29.1
I2C4_SDA: P18.5 R28.1
I2S_CLK: P18.31
I2S_SD: P18.29
I2S_SEL: P18.33
I2S_W: P18.27
MOTOREN: U20.10(EN)
MOTORGOOD: U20.14(PWRGD)
PB5: P22.10
PC5: P22.18
PD2: P22.16
PD4: P22.14
PD7: P22.12
PE10: P22.20
PF10: P22.22
PF13: P22.24
PG6: P22.26
RASP_CS: P22.13
RASP_IO1: P22.25
RASP_IO2: P22.27
RASP_MISO: P22.17
RASP_MOSI: P22.15
RASP_SCK: P22.19
RASP_SCL: P22.21
RASP_SDA: P22.23
SPI2_CLK: P18.19
SPI2_MISO: P18.15
SPI2_MOSI: P18.17
SPI2_NSS: P18.13
SPI4_CLK: P18.32
SPI4_MISO: P18.34
SPI4_MOSI: P18.36
SPI4_NSS: P18.30
UART_RX: P18.37
UART_TX: P18.35
VSENSE1: R39.1 R41.2 U21.7(VSENSE)
VSENSE2: R37.1 R40.2 U20.7(VSENSE)
NetC87_1: C87.1 D10.2(K) D12.2(K) U18.1(VIN)
NetC90_1: C90.1 U20.13(BOOT)
NetC90_2: C90.2 L16.1 U20.11(PH) U20.12(PH)
NetC91_1: C91.1 D13.3(OUT) U20.4(PVIN) U20.5(PVIN) U20.6(VIN)
NetC92_1: C92.1 U21.13(BOOT)
NetC92_2: C92.2 L17.1 U21.11(PH) U21.12(PH)
NetC93_1: C93.1 D14.3(OUT) U21.4(PVIN) U21.5(PVIN) U21.6(VIN)
NetC96_1: C96.1 U20.9(SS/TR)
NetC97_1: C97.1 U21.9(SS/TR)
NetC98_1: C98.1 R36.2 U20.8(COMP)
NetC99_1: C99.1 R38.2 U21.8(COMP)
NetC100_1: C100.1 R36.1
NetC101_1: C101.1 R38.1
NetD7_1: D7.1(A) J7.1
NetD8_1: D8.1(IN1) D8.2(IN2) P19.1 R30.2
NetD9_2: D9.2(K) L14.1 U17.2(OUT)
NetD11_2: D11.2(K) L15.1 U18.2(OUT)
NetP19_2: P19.2 P20.1 P21.1
NetR32_1: R32.1 U19.5(FLG)
NetR34_2: R34.2 U20.1(RT/CLK)
NetR35_2: R35.2 U21.1(RT/CLK)

Not connected (* = marked no-connect by the designer): P18 2 8 10 12 14 23 28 39; P22 28 30 32 34 36 38 40; U21 10(EN) 14(PWRGD)

### Library data of the parts
C80 C81 C87 C88 C91 C93 = Cap Pol1: Polarized Capacitor (Radial); Published: 8-Jun-2000; LatestRevisionDate: 17-Jul-2002; LatestRevisionNote: Re-released for DXP Platform.; PackageReference: RB7.6-15; Publisher: Altium Limited; PackageDescription: Polarized Capacitor (Radial); 2 Leads
D7 D9-D12 = Diode 1N5401: 3 Amp General Purpose Rectifier; Published: 8-Jun-2000; LatestRevisionDate: 17-Jul-2002; LatestRevisionNote: Re-released for DXP Platform.; DatasheetVersion: 1998; PackageVersion: Aug-1999; PackageReference: DO-201AD; Publisher: Altium Limited; PackageDescription: Diode, Axial; Body 9.5 x 5.6 mm (LxDia. max), Lead Dia. 1.32 mm (max); ComponentLink1Description: Manufacturer Link; ComponentLink1URL: http://www.fairchildsemi.com/; ComponentLink2Description: Datasheet; ComponentLink2URL: http://www.fairchildsemi.com/ds/1N%2F1N5400.pdf
D8 = Diode Array: pin to pad: 2>3 3>4
D13 D14 = Diode Array
J7 = PWR2.5: Low Voltage Power Supply Connector; Published: 17-Dec-2003; DatasheetDocument: 09-May-2002; Publisher: Altium Limited; ComponentLink1Description: Manufacturer Link; ComponentLink1URL: http://domino.kycon.com/internet/Products.html
L14 L15 = Inductor: Code_IEC: 1005; Published: 8-Jun-2000; LatestRevisionDate: 29-May-2009; LatestRevisionNote: IPC-7351 Footprint Added.; PackageReference: 0402-A; Publisher: Altium Limited; PackageDescription: Chip Inductor; Code_JEITA: 0402
L16 L17 = Inductor
P18 P22 = Header 20X2: Header, 20-Pin, Dual row; LatestRevisionDate: 17-Jul-2002; LatestRevisionNote: Re-released for DXP Platform.; Publisher: Altium Limited
P19-P21 P23 = Header 2: Header, 2-Pin; LatestRevisionDate: 17-Jul-2002; LatestRevisionNote: Re-released for DXP Platform.; Publisher: Altium Limited
R23 R28-R41 = Resistor: General Purpose Resistor; Digikey: *
  R28 R29 R37 R39-R41: Value: ?
U17 U18 = LM2576HVS: No Description Available
U19 = AP2401S-13: No Description Available; Vendor: Diodes Inc; Built_By: EMA_UL_Team; Manufacturer_Part_Number: AP2401S-13; Copyright: Copyright (C) 2018 Accelerated Designs. All rights reserved; RefDes: RefDes; Type: DEV; Value: Value
U20 U21 = TPS54821RHLT: No Description Available
C76-C79 C82-C86 C89 C90 C92 C94-C101 = Ceramic Capacitor: Digikey: *

## Nets that join several sheets
3.3V: MCU (39 pins), Peripherals (C41.1 J5.22 L4.1 R22.1), Power (16 pins)
5V: MCU (21 pins), Peripherals (12 pins), Power (14 pins)
5V_U_RAW: MCU (6 pins), Peripherals (C38.1 C68.1 J4.1 U15.15), Power (R32.2 U19.2 U19.3)
GND: MCU (106 pins), Peripherals (80 pins), Power (60 pins)
VCC_Motor1: Peripherals (5 pins), Power (C95.1 L17.2 R23.1 R39.2)
VCC_Motor2: Peripherals (C66.1 C67.2 U14.16), Power (C94.1 L16.2 R23.2 R37.2)
2.4_SW: MCU (U4.56), Peripherals (U13.7)
ADC1: MCU (U4.42), Power (P18.38)
ADC2: MCU (U4.29), Power (P18.40)
BAT_ADC: MCU (U1.3), Power (C82.2 R30.1 R31.2)
CAM_CLKN: MCU (U4.85), Peripherals (J5.8)
CAM_CLKP: MCU (U4.86), Peripherals (J5.9)
CAM_D0N: MCU (U4.139), Peripherals (J5.2)
CAM_D0P: MCU (U4.140), Peripherals (J5.3)
CAM_D1N: MCU (U4.69), Peripherals (J5.5)
CAM_D1P: MCU (U4.70), Peripherals (J5.6)
CAM_EN: MCU (U4.80), Peripherals (J5.17)
CAM_IO: MCU (U4.79), Peripherals (J5.18)
CAM_SCL: MCU (R9.2 U4.136), Peripherals (J5.20)
CAM_SDA: MCU (R8.2 U4.137), Peripherals (J5.21)
CC_MISO: Peripherals (U12.38), Power (P22.6)
CC_MOSI: Peripherals (U12.39), Power (P22.4)
CC_NSS: Peripherals (U12.40), Power (P22.2)
CC_RXD: MCU (U4.77), Peripherals (U12.11)
CC_SCK: Peripherals (U12.37), Power (P22.8)
CC_TXD: MCU (U4.78), Peripherals (U12.12)
CCGPIO1: MCU (U4.68), Peripherals (U12.15)
CCGPIO2: MCU (U4.65), Peripherals (U12.16)
CCGPIO3: Peripherals (U12.17), Power (P18.4)
ESP_SCL: MCU (P10.28), Power (P18.16)
ESP_SDA: MCU (P10.22), Power (P18.18)
ESPGPIO3: MCU (P10.18), Power (P18.25)
I2C4_SCL: MCU (U4.54), Power (P18.3 R29.1)
I2C4_SDA: MCU (U4.55), Power (P18.5 R28.1)
I2S_CLK: MCU (U4.111), Power (P18.31)
I2S_SD: MCU (U4.48), Power (P18.29)
I2S_SEL: MCU (U4.112), Power (P18.33)
I2S_W: MCU (U4.40), Power (P18.27)
LED1: MCU (U4.87), Peripherals (R13.1)
LED2: MCU (U4.89), Peripherals (R14.1)
LED3: MCU (U4.88), Peripherals (R19.1)
LED4: MCU (U4.90), Peripherals (R20.1)
M1DIR: MCU (U4.64), Peripherals (P15.2)
M1H1: MCU (U4.13), Peripherals (P13.6)
M1H2: MCU (U4.14), Peripherals (P13.5)
M1PWM: MCU (U4.60), Peripherals (P15.1)
M2DIR: MCU (U4.35), Peripherals (P15.4)
M2H1: MCU (U4.20), Peripherals (P14.6)
M2H2: MCU (U4.21), Peripherals (P14.5)
M2PWM: MCU (U4.34), Peripherals (P15.3)
M3DIR: MCU (U4.97), Peripherals (P15.6)
M3H1: MCU (U4.49), Peripherals (P16.6)
M3H2: MCU (U4.50), Peripherals (P16.5)
M3PWM: MCU (U4.96), Peripherals (P15.5)
M4DIR: MCU (U4.82), Peripherals (P15.8)
M4H1: MCU (U4.46), Peripherals (P17.6)
M4H2: MCU (U4.47), Peripherals (P17.5)
M4PWM: MCU (U4.81), Peripherals (P15.7)
M_FAULT: MCU (U4.127), Peripherals (R25.2 U14.12)
M_SLEEP: MCU (U4.128), Peripherals (U14.8)
MOTOR_MISO: MCU (U4.134), Peripherals (U14.7)
MOTOR_MOSI: MCU (U4.43), Peripherals (U14.5)
MOTOR_NSS: MCU (U4.125), Peripherals (U14.19)
MOTOR_SCK: MCU (U4.126), Peripherals (U14.20)
MOTOREN: MCU (U4.92), Power (U20.10)
MOTORGOOD: MCU (U4.93), Power (U20.14)
PA_SW: MCU (U4.58), Peripherals (U13.3)
PB5: MCU (U4.135), Power (P22.10)
PC5: MCU (U4.45), Power (P22.18)
PD2: MCU (U4.116), Power (P22.16)
PD4: MCU (U4.118), Power (P22.14)
PD7: MCU (U4.123), Power (P22.12)
PE10: MCU (U4.63), Power (P22.20)
PF10: MCU (U4.22), Power (P22.22)
PF13: MCU (U4.53), Power (P22.24)
PG6: MCU (U4.91), Power (P22.26)
RASP_CS: MCU (P7.22), Power (P22.13)
RASP_IO1: MCU (P7.38), Power (P22.25)
RASP_IO2: MCU (P7.40), Power (P22.27)
RASP_MISO: MCU (P7.21), Power (P22.17)
RASP_MOSI: MCU (P7.19), Power (P22.15)
RASP_SCK: MCU (P7.23), Power (P22.19)
RASP_SCL: MCU (P7.5), Power (P22.21)
RASP_SDA: MCU (P7.3), Power (P22.23)
SPI2_CLK: MCU (U4.117), Power (P18.19)
SPI2_MISO: MCU (U4.28), Power (P18.15)
SPI2_MOSI: MCU (U4.27), Power (P18.17)
SPI2_NSS: MCU (U4.26), Power (P18.13)
SPI4_CLK: MCU (U4.1), Power (P18.32)
SPI4_MISO: MCU (U4.67), Power (P18.34)
SPI4_MOSI: MCU (U4.66), Power (P18.36)
SPI4_NSS: MCU (U4.59), Power (P18.30)
SUB_SW: MCU (U4.57), Peripherals (U13.6)
UART_RX: MCU (U4.18), Power (P18.37)
UART_TX: MCU (U4.19), Power (P18.35)